# Altium schematic sheet Sheet1.SchDoc
size A
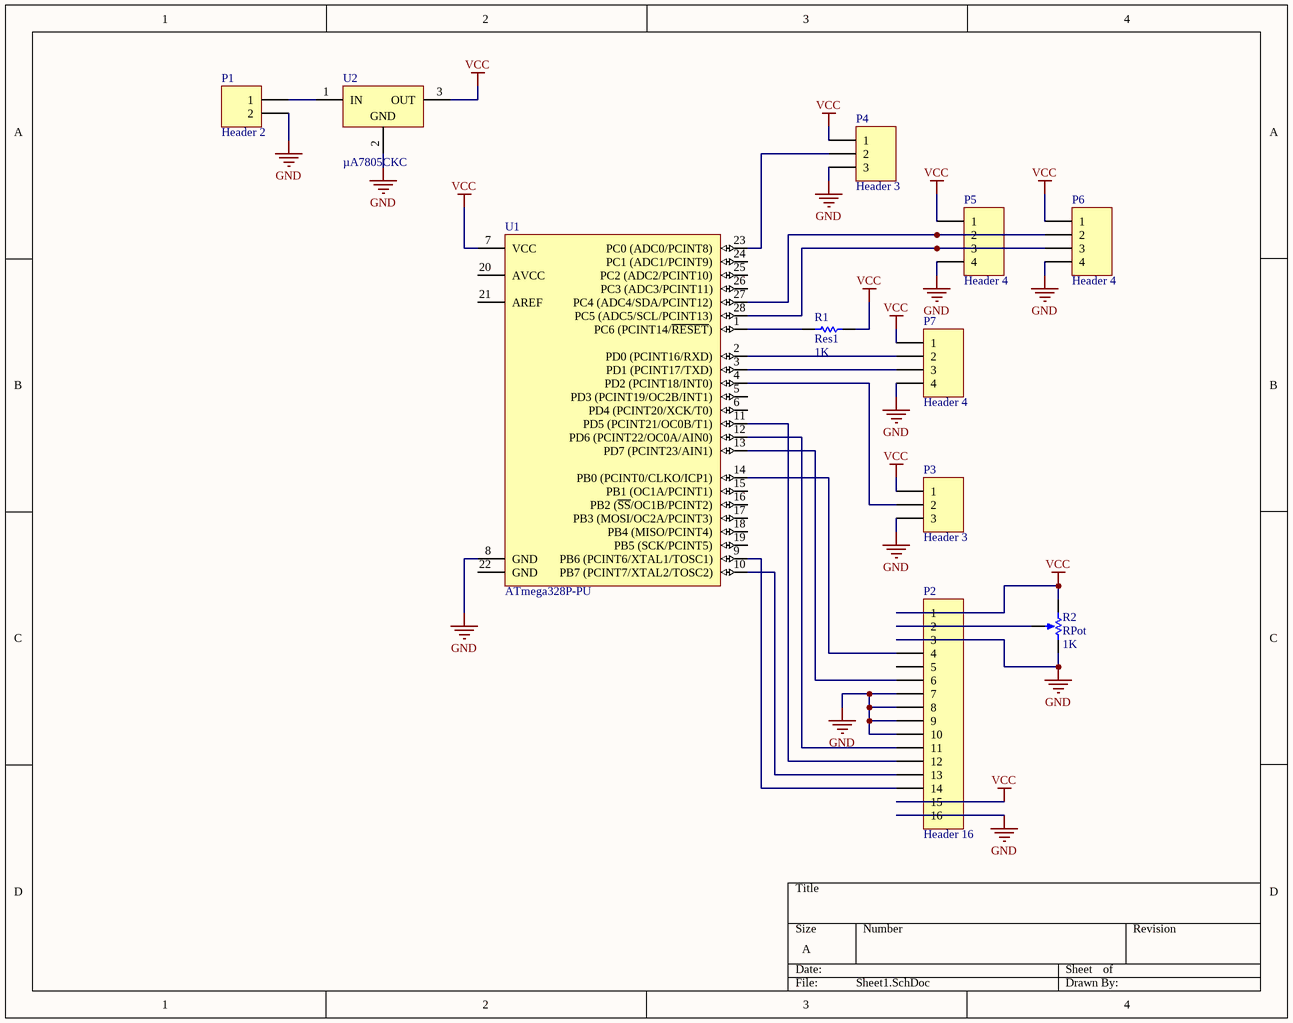
[diagram p0: Sheet1.SchDoc]

## Parts
P1  Header 2  [HDR1X2]
P2  Header 16  [HDR1X16]
P3  Header 3  [HDR1X3]
P4  Header 3  [HDR1X3]
P5  Header 4  [HDR1X4]
P6  Header 4  [HDR1X4]
P7  Header 4  [HDR1X4]
R1  Res1  value 1K  [AXIAL-0.3]
R2  RPot  value 1K  [VR5]
U1  ATmega328P-PU  [28P3]
U2  µA7805CKC  [KC03]

## Nets
GND: P1.2 P2.3 P2.7 P2.8 P2.9 P2.10 P2.16 P3.3 P4.3 P5.4 P6.4 P7.4 R2.2(BOT) U1.8(GND) U2.2(GND)
VCC: P2.1 P2.15 P3.1 P4.1 P5.1 P6.1 P7.1 R1.2 R2.1(TOP) U1.7(VCC) U2.3(OUT)
NetP1_1: P1.1 U2.1(IN)
NetP2_2: P2.2 R2.3(TAP)
NetP2_4: P2.4 U1.14(PB0_(PCINT0/CLKO/ICP1))
NetP2_6: P2.6 U1.13(PD7_(PCINT23/AIN1))
NetP2_11: P2.11 U1.12(PD6_(PCINT22/OC0A/AIN0))
NetP2_12: P2.12 U1.11(PD5_(PCINT21/OC0B/T1))
NetP2_13: P2.13 U1.10(PB7_(PCINT7/XTAL2/TOSC2))
NetP2_14: P2.14 U1.9(PB6_(PCINT6/XTAL1/TOSC1))
NetP3_2: P3.2 U1.4(PD2_(PCINT18/INT0))
NetP4_2: P4.2 U1.23(PC0_(ADC0/PCINT8))
NetP5_2: P5.2 P6.2 U1.27(PC4_(ADC4/SDA/PCINT12))
NetP5_3: P5.3 P6.3 U1.28(PC5_(ADC5/SCL/PCINT13))
NetP7_2: P7.2 U1.2(PD0_(PCINT16/RXD))
NetP7_3: P7.3 U1.3(PD1_(PCINT17/TXD))
NetR1_1: R1.1 U1.1(PC6_(PCINT14/~{RESET}))

Not connected (* = marked no-connect by the designer): P2 5; U1 5(PD3_(PCINT19/OC2B/INT1)) 6(PD4_(PCINT20/XCK/T0)) 15(PB1_(OC1A/PCINT1)) 16(PB2_(~{SS}/OC1B/PCINT2)) 17(PB3_(MOSI/OC2A/PCINT3)) 18(PB4_(MISO/PCINT4)) 19(PB5_(SCK/PCINT5)) 20(AVCC) 21(AREF) 22(GND) 24(PC1_(ADC1/PCINT9)) 25(PC2_(ADC2/PCINT10)) 26(PC3_(ADC3/PCINT11))

## Library data of the parts
P1 = Header 2: Header, 2-Pin; LatestRevisionDate: 17-Jul-2002; LatestRevisionNote: Re-released for DXP Platform.; Publisher: Altium Limited
P2 = Header 16: Header, 16-Pin; LatestRevisionDate: 17-Jul-2002; LatestRevisionNote: Re-released for DXP Platform.; Publisher: Altium Limited
P3 P4 = Header 3: Header, 3-Pin; LatestRevisionDate: 17-Jul-2002; LatestRevisionNote: Re-released for DXP Platform.; Publisher: Altium Limited
P5-P7 = Header 4: Header, 4-Pin; LatestRevisionDate: 17-Jul-2002; LatestRevisionNote: Re-released for DXP Platform.; Publisher: Altium Limited
R1 = Res1: Resistor; Published: 8-Jun-2000; LatestRevisionDate: 17-Jul-2002; LatestRevisionNote: Re-released for DXP Platform.; PackageReference: AXIAL-0.3; Publisher: Altium Limited; PackageDescription: Axial Device, Thru-Hole; 2 Leads; 0.3 in Pin Spacing
R2 = RPot: Potentiometer; Sim Note: Enter the Resistance value and the set point into parameter fields.; Set Position: 0.5; Published: 8-Jun-2000; LatestRevisionDate: 17-Jul-2002; LatestRevisionNote: Re-released for DXP Platform.; PackageReference: VR5; Publisher: Altium Limited; PackageDescription: Variable Resistor, Thru-Hole; 3 Leads
U1 = ATmega328P-PU: 8-bit AVR Microcontroller, 32KB Flash, 1KB EEPROM, 2KB SRAM, 28-pin PDIP, Industrial Grade (-40°C to 85°C); Published: 1-Apr-2010; DatasheetVersion: revA, Jan-2010; PackageVersion: revB, Sep-2001; PackageReference: 28P3; Publisher: Altium Limited; PackageDescription: 28-lead (0.300"/7.62mm Wide) Plastic Dual Inline Package (PDIP); Supplier 1: Digi-Key; Supplier Part Number 1: ATMEGA328P-PU-ND; Supplier 2: Farnell; Supplier Part Number 2: 1715487; Supplier 3: Mouser; Supplier Part Number 3: 556-ATMEGA328P-PU; ComponentLink1Description: Manufacturer Link; ComponentLink1URL: http://www.atmel.com/products/avr/default.asp?; ComponentLink2Description: ATmega48A/48PA/88A/88PA/168A/168PA/328/328P Datasheet; ComponentLink2URL: http://www.atmel.com/dyn/resources/prod_documents/8271.pdf; ComponentLink3Description: ATmega48A/48PA/88A/88PA/168A/168PA/328/328P Summary; ComponentLink3URL: http://www.atmel.com/dyn/resources/prod_documents/8271S.pdf; ComponentLink4Description: Atmel.com Home; ComponentLink4URL: http://www.atmel.com
U2 = µA7805CKC: Positive-Voltage Regulator; Note: Pin 2 is electrically connected to TAB.; Published: 15-Apr-2002; DatasheetVersion: Jul-1999; PackageVersion: Sep-1995; PackageReference: KC03; Publisher: Altium Limited; PackageDescription: TO, Thru-Hole, Vertical, Heatsink Mounted; 3 In-Line Leads; Pitch 2.54 mm; ComponentLink1Description: Manufacturer Link; ComponentLink1URL: http://www.ti.com/; ComponentLink2Description: Datasheet; ComponentLink2URL: http://www-s.ti.com/sc/ds/ua7805.pdf